# Altium schematic sheet MFR-25FBF52-4K71_MFR-25FBF52-4K7.schdoc
size 127 x 99 mm
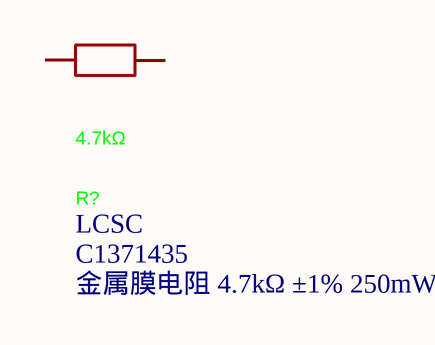
[diagram p0: MFR-25FBF52-4K71_MFR-25FBF52-4K7.schdoc]

## Parts
R?  4.7kΩ  LCSC Part Name: 金属膜电阻 4.7kΩ ±1% 250mW  Supplier Part: C1371435  Supplier: LCSC  [RES-TH_BD2.4-L6.3-P10.30-D0.6]

## Nets

Not connected (* = marked no-connect by the designer): R? 1 2

## Library data of the parts
R? = MFR-25FBF52-4K7: Manufacturer: YAGEO(国巨); Add into BOM: yes; Tolerance: ±1%; Power(Watts): 250mW; Temperature Coefficient: ±100ppm/℃; Symbol: MFR-25FBF52-4K7; Device: MFR-25FBF52-4K7; Manufacturer Part: MFR-25FBF52-4K7; Value: 4.7kΩ; Supplier Footprint: 插件,D2.4xL6.3mm; JLCPCB Part Class: Extended Part; Datasheet: https://item.szlcsc.com/datasheet/MFR-25FBF52-4K7/1461724.html; Convert to PCB: yes; Type: Metal Film Resistor; Operating Temperature: -55℃~+155℃